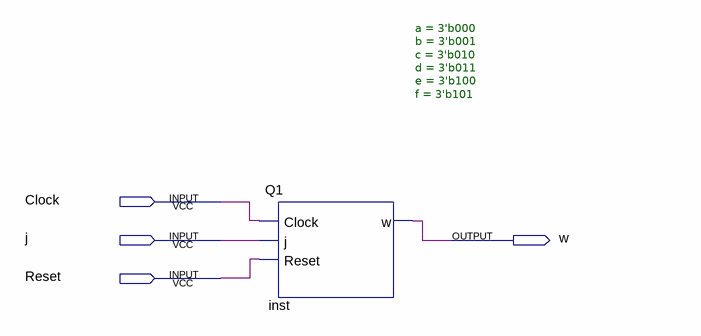
[diagram p0: schematic sheet]
// Quartus schematic Q1_BlockDiagram.bdf as structural Verilog: 1 symbols, 4 pins
module Q1_BlockDiagram (
  input  Clock,
  input  j,
  input  Reset,
  output w
);

  Q1 #(.a(3'b000), .b(3'b001), .c(3'b010), .d(3'b011), .e(3'b100), .f(3'b101)) inst (
    .Clock(Clock), .j(j), .Reset(Reset), .w(w));
endmodule
